# EAGLE design Esquematico (EAGLE 9.6.2)
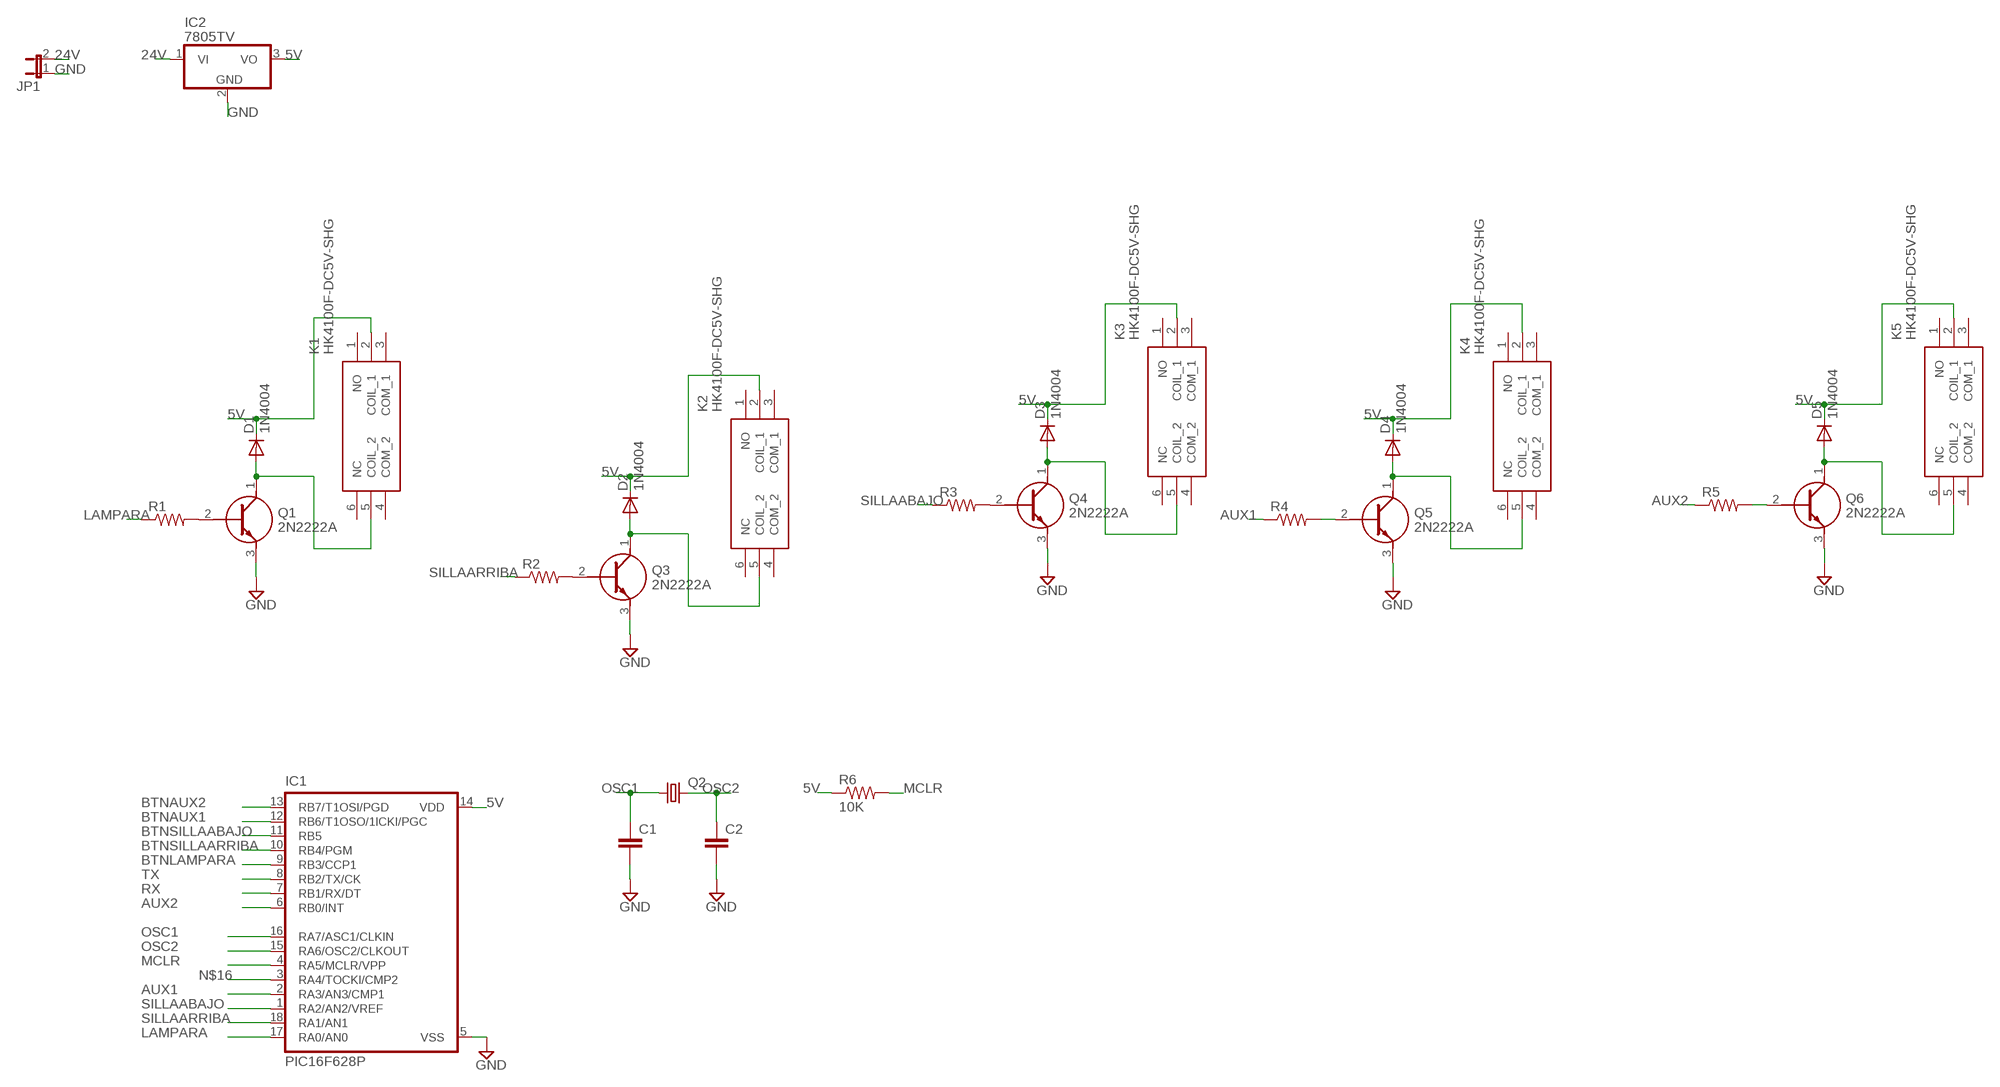
[diagram p0: schematic, sheet 1]

## Parts
C1  C2,5-3  [C2.5-3]
C2  C2,5-3  [C2.5-3]
D1  1N4004  [DO41-10]
D2  1N4004  [DO41-10]
D3  1N4004  [DO41-10]
D4  1N4004  [DO41-10]
D5  1N4004  [DO41-10]
IC1  PIC16F628P  [DIL18]
IC2  7805TV  [TO220V]
JP1  JP1E  [JP1]
K1  HK4100F-DC5V-SHG  [HK4100FDC5VSHG]
K2  HK4100F-DC5V-SHG  [HK4100FDC5VSHG]
K3  HK4100F-DC5V-SHG  [HK4100FDC5VSHG]
K4  HK4100F-DC5V-SHG  [HK4100FDC5VSHG]
K5  HK4100F-DC5V-SHG  [HK4100FDC5VSHG]
Q1  2N2222A  [2N2222A]
Q2  CRYSTALHC49U70  [HC49U70]
Q3  2N2222A  [2N2222A]
Q4  2N2222A  [2N2222A]
Q5  2N2222A  [2N2222A]
Q6  2N2222A  [2N2222A]
R1  R-US_0207/7  [0207/7]
R2  R-US_0207/7  [0207/7]
R3  R-US_0207/7  [0207/7]
R4  R-US_0207/7  [0207/7]
R5  R-US_0207/7  [0207/7]
R6  10K  R-US_0207/7  [0207/7]

## Nets
5V: D1.C D2.C D3.C D4.C D5.C IC1.14(VDD) IC2.3(VO) K1.2(COIL_1) K2.2(COIL_1) K3.2(COIL_1) K4.2(COIL_1) K5.2(COIL_1) R6.1
24V: IC2.1(VI) JP1.2
AUX1: IC1.2(RA3/AN3/CMP1) R4.1
AUX2: IC1.6(RB0/INT) R5.1
BTNAUX1: IC1.12(RB6/T1OSO/1ICKI/PGC)
BTNAUX2: IC1.13(RB7/T1OSI/PGD)
BTNLAMPARA: IC1.9(RB3/CCP1)
BTNSILLAABAJO: IC1.11(RB5)
BTNSILLAARRIBA: IC1.10(RB4/PGM)
GND: C1.2 C2.2 IC1.5(VSS) IC2.2(GND) JP1.1 Q1.3(E) Q3.3(E) Q4.3(E) Q5.3(E) Q6.3(E)
LAMPARA: IC1.17(RA0/AN0) R1.1
MCLR: IC1.4(RA5/MCLR/VPP) R6.2
N$1: Q1.2(B) R1.2
N$2: D1.A K1.5(COIL_2) Q1.1(C)
N$3: Q3.2(B) R2.2
N$4: D2.A K2.5(COIL_2) Q3.1(C)
N$5: Q4.2(B) R3.2
N$6: D3.A K3.5(COIL_2) Q4.1(C)
N$7: Q5.2(B) R4.2
N$8: D4.A K4.5(COIL_2) Q5.1(C)
N$9: Q6.2(B) R5.2
N$10: D5.A K5.5(COIL_2) Q6.1(C)
N$16: IC1.3(RA4/TOCKI/CMP2)
OSC1: C1.1 IC1.16(RA7/ASC1/CLKIN) Q2.1
OSC2: C2.1 IC1.15(RA6/OSC2/CLKOUT) Q2.2
RX: IC1.7(RB1/RX/DT)
SILLAABAJO: IC1.1(RA2/AN2/VREF) R3.1
SILLAARRIBA: IC1.18(RA1/AN1) R2.1
TX: IC1.8(RB2/TX/CK)
Unconnected: K1.1(NO) K1.3(COM_1) K1.4(COM_2) K1.6(NC) K2.1(NO) K2.3(COM_1) K2.4(COM_2) K2.6(NC) K3.1(NO) K3.3(COM_1) K3.4(COM_2) K3.6(NC) K4.1(NO) K4.3(COM_1) K4.4(COM_2) K4.6(NC) K5.1(NO) K5.3(COM_1) K5.4(COM_2) K5.6(NC)

## Library data of the parts
C1 C2 = capacitor-wima:C: CAPACITOR naming: grid - package width
D1-D5 = adafruit:1N4004: DIODE General purpose 1N400x type rectifier (With bigger pads) http://www.ladyada.net/library/pcb/eaglelibrary.html
IC1 = microchip:PIC16*F62: FLASH-Based 8-Bit CMOS Microcontroller Source: http://ww1.microchip.com/downloads/en/DeviceDoc/40300C.pdf; MF: MICROCHIP; MPN: PIC16F628-20/P; OC_FARNELL: 9760423; OC_NEWARK: 23C4982
IC2 = linear:78*: Positive VOLTAGE REGULATOR Source: http://cache.national.com/ds/LM/LM78L05.pdf http://www.fairchildsemi.com/ds/LM/LM7805.pdf
JP1 = jumper:JP1E: JUMPER
K1-K5 = SamacSys_Parts:HK4100F-DC5V-SHG: Relays General Purpose Non Latching 5VDC SPDT 3A (250VAC , 30VDC) Max DIP RoHS Source: Datasheet <https://datasheet.lcsc.com/szlcsc/1905051831_Ningbo-Keke-New-Era-Appliance-HK4100F-DC5V-SHG_C12072.pdf>; DESCRIPTION: Relays General Purpose Non Latching 5VDC SPDT 3A (250VAC , 30VDC) Max DIP RoHS; HEIGHT: 12.1mm; MANUFACTURER_NAME: Ningbo Keke New Era Appliance; MANUFACTURER_PART_NUMBER: HK4100F-DC5V-SHG
Q1 Q3-Q6 = SamacSys_Parts:2N2222A: Silicon NPN transistor in a TO-92 Plastic Package. Source: Datasheet <https://datasheet.lcsc.com/szlcsc/1901291437_Foshan-Blue-Rocket-Elec-2N2222A_C358533.pdf>; DESCRIPTION: Silicon NPN transistor in a TO-92 Plastic Package.; HEIGHT: 4.7mm; MANUFACTURER_NAME: Foshan Blue Rocket Elec; MANUFACTURER_PART_NUMBER: 2N2222A
Q2 = adafruit:CRYSTAL: CRYSTAL; OC_FARNELL: unknown; OC_NEWARK: unknown
R1-R6 = adafruit:R-US_: RESISTOR, American symbol

## Board
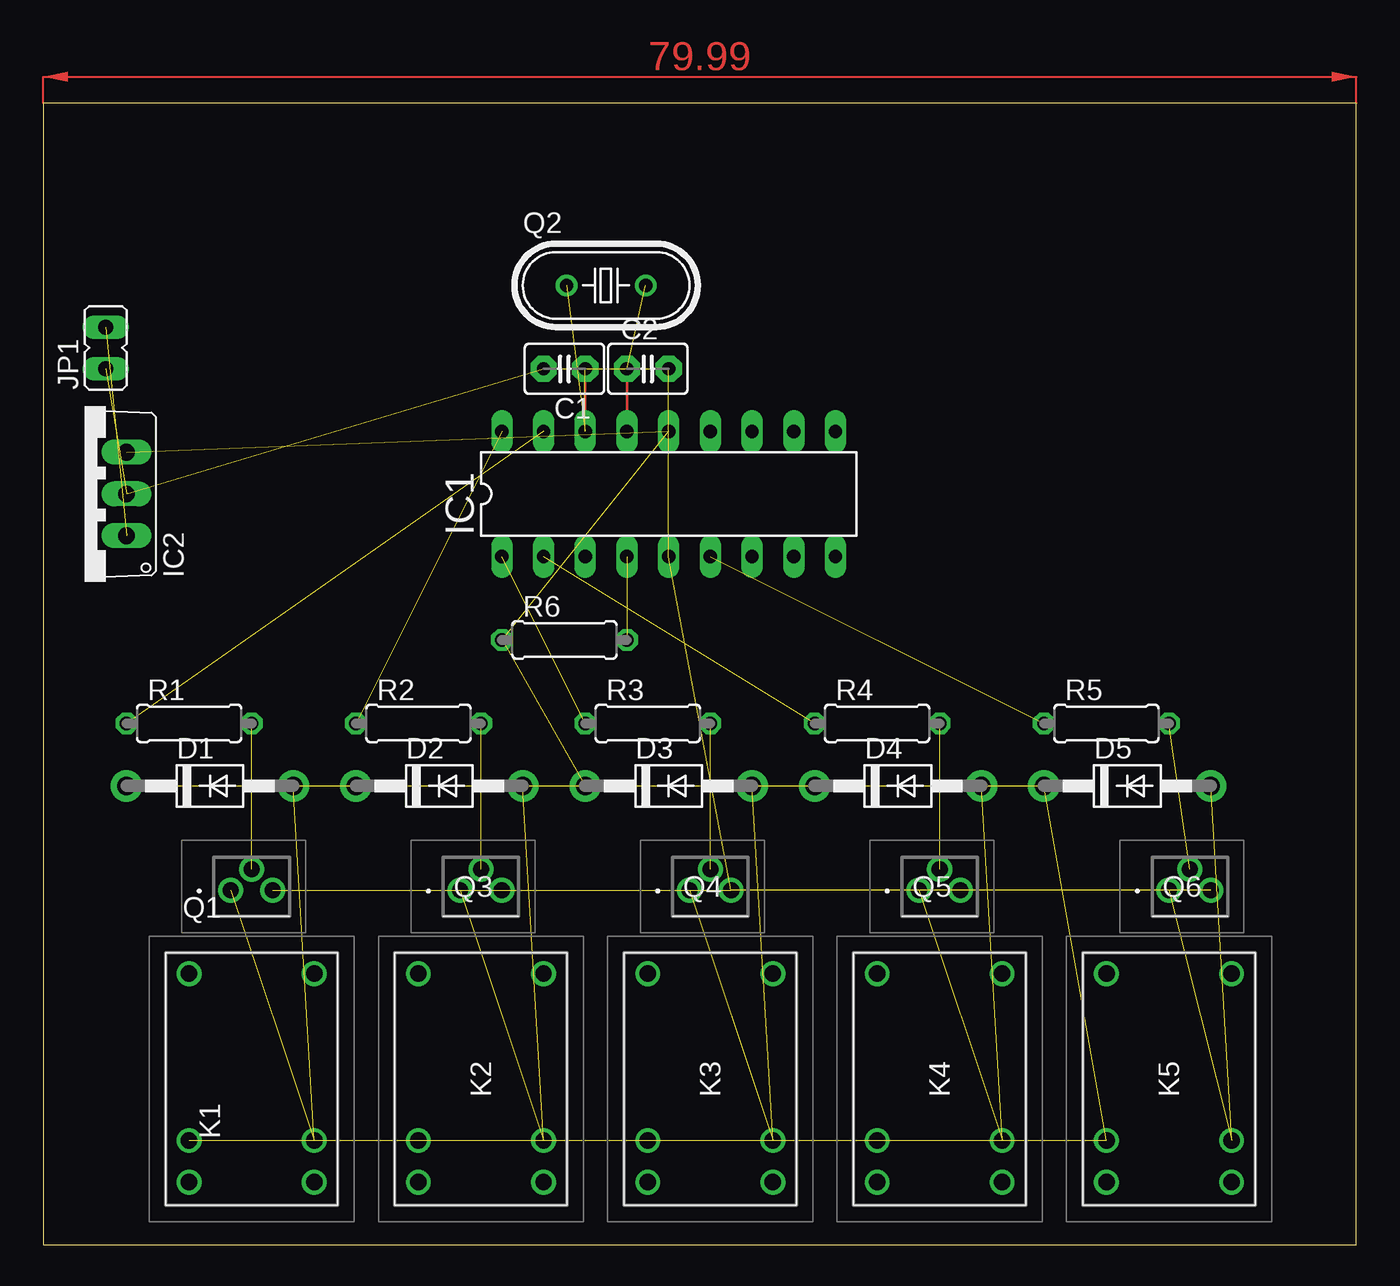
[diagram p1: board, top side]

Size 79.99 x 69.52 mm. Coordinates in mm from the lower left corner, seen from the top.
Outline: 0,0 79.99,0 79.99,69.52 0,69.52 0,0
Copper layers (1*16): Top 0.035mm / dielectric 1.5mm / Bottom 0.035mm
Design rules "default": minimum track width 6mil, minimum drill 0.35mm, track to track 6mil, track to pad 6mil, pad to pad 6mil, via to via 6mil, smd to smd 6mil, copper to edge 40mil, drill to drill 6mil, minimum pad ring 10mil, minimum via ring 8mil, stop-mask expansion 4mil, vias tented up to drill 0mil, thermal gap 10mil

### Footprints (pad centres in the part's own frame; a part is rotated, then mirrored left to right if it is on the bottom)
C2.5-3 = drill 0.813 pad 1.6 octagon: 1 -1.27,0; 2 1.27,0
DO41-10 = drill 1.118 pad 1.93: A 5.08,0; C -5.08,0
DIL18 = drill 0.813 long: 1 -10.16,-3.81; 2 -7.62,-3.81; 3 -5.08,-3.81; 4 -2.54,-3.81; 5 0,-3.81; 6 2.54,-3.81; 7 5.08,-3.81; 8 7.62,-3.81; 9 10.16,-3.81; 10 10.16,3.81; 11 7.62,3.81; 12 5.08,3.81; 13 2.54,3.81; 14 0,3.81; 15 -2.54,3.81; 16 -5.08,3.81; 17 -7.62,3.81; 18 -10.16,3.81
TO220V = drill 1.016 long: 1 -2.54,-2.54; 2 0,-2.54; 3 2.54,-2.54
JP1 = drill 0.914 long: 1 0,-1.27; 2 0,1.27
HK4100FDC5VSHG = drill 1 pad 1.5: 1 0,0; 2 2.54,0; 3 12.7,0; 4 12.7,-7.62; 5 2.54,-7.62; 6 0,-7.62
2N2222A = drill 0.981 pad 1.526: 1 0,0; 2 1.27,1.27; 3 2.54,0
HC49U70 = drill 0.813: 1 -2.413,0; 2 2.413,0
0207/7 = drill 0.813 octagon: 1 -3.81,0; 2 3.81,0

### Placement (x,y rotation side)
C1  31.75,53.34 180 top
C2  36.83,53.34 0 top
D1  10.16,27.94 0 top
D2  24.13,27.94 0 top
D3  38.1,27.94 0 top
D4  52.07,27.94 0 top
D5  66.04,27.94 0 top
IC1  38.1,45.72 0 top
IC2  2.54,45.72 90 top
JP1  3.81,54.61 0 top
K1  8.89,3.81 90 top
K2  22.86,3.81 90 top
K3  36.83,3.81 90 top
K4  50.8,3.81 90 top
K5  64.77,3.81 90 top
Q1  11.43,21.59 0 top
Q2  34.29,58.42 0 top
Q3  25.4,21.59 0 top
Q4  39.37,21.59 0 top
Q5  53.34,21.59 0 top
Q6  68.58,21.59 0 top
R1  8.89,31.75 0 top
R2  22.86,31.75 0 top
R3  36.83,31.75 0 top
R4  50.8,31.75 0 top
R5  64.77,31.75 0 top
R6  31.75,36.83 0 top

### Tracks (layer width: path | path; a pad name or v marks a point on that pad's centre or on a via)
5V  (12 unrouted)
24V  (1 unrouted)
AUX1  (1 unrouted)
AUX2  (1 unrouted)
GND  (9 unrouted)
LAMPARA  (1 unrouted)
MCLR  (1 unrouted)
N$1  (1 unrouted)
N$2  (2 unrouted)
N$3  (1 unrouted)
N$4  (2 unrouted)
N$5  (1 unrouted)
N$6  (2 unrouted)
N$7  (1 unrouted)
N$8  (2 unrouted)
N$9  (1 unrouted)
N$10  (2 unrouted)
OSC1  (3 unrouted)
  Top 0.152: C1.1 IC1.16
OSC2  (1 unrouted)
  Top 0.152: C2.1 IC1.15
SILLAABAJO  (1 unrouted)
SILLAARRIBA  (1 unrouted)
(copper drawn outside any net)
  shapes: Top area x1